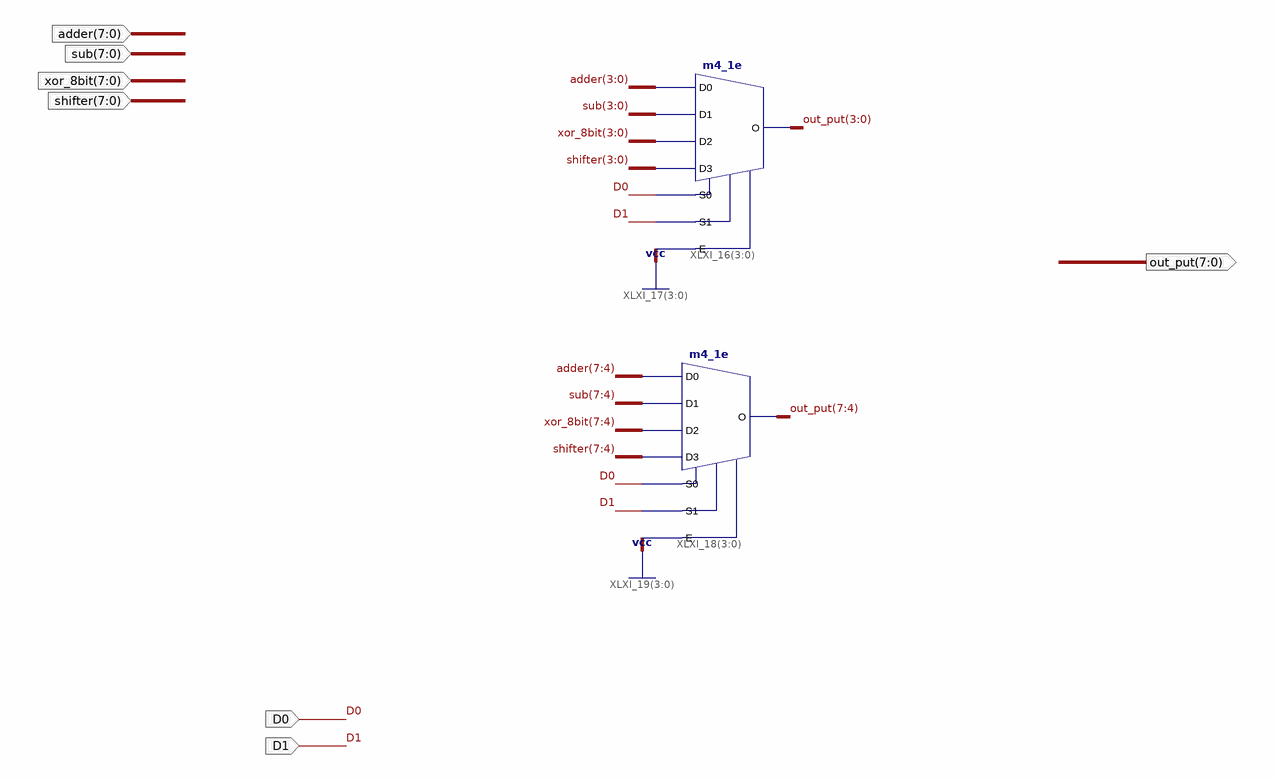
[diagram p0: schematic sheet 1]
// Xilinx ISE schematic select_application.sch (spartan6) as structural Verilog: 2 symbols, 7 ports
module select_application (
  input  D1,
  input  D0,
  input  [7:0] adder,
  input  [7:0] sub,
  input  [7:0] xor_8bit,
  input  [7:0] shifter,
  output [7:0] out_put
);

  m4_1e XLXI_16[3:0] (
    .D0(adder[3:0]), .D1(sub[3:0]), .D2(xor_8bit[3:0]), .D3(shifter[3:0]), .E(4'b1111), .S0(D0), .S1(D1),
    .O(out_put[3:0]));
  m4_1e XLXI_18[3:0] (
    .D0(adder[7:4]), .D1(sub[7:4]), .D2(xor_8bit[7:4]), .D3(shifter[7:4]), .E(4'b1111), .S0(D0), .S1(D1),
    .O(out_put[7:4]));
endmodule
